# Altium schematic sheet nfc-epd-eink.SchDoc
size Letter
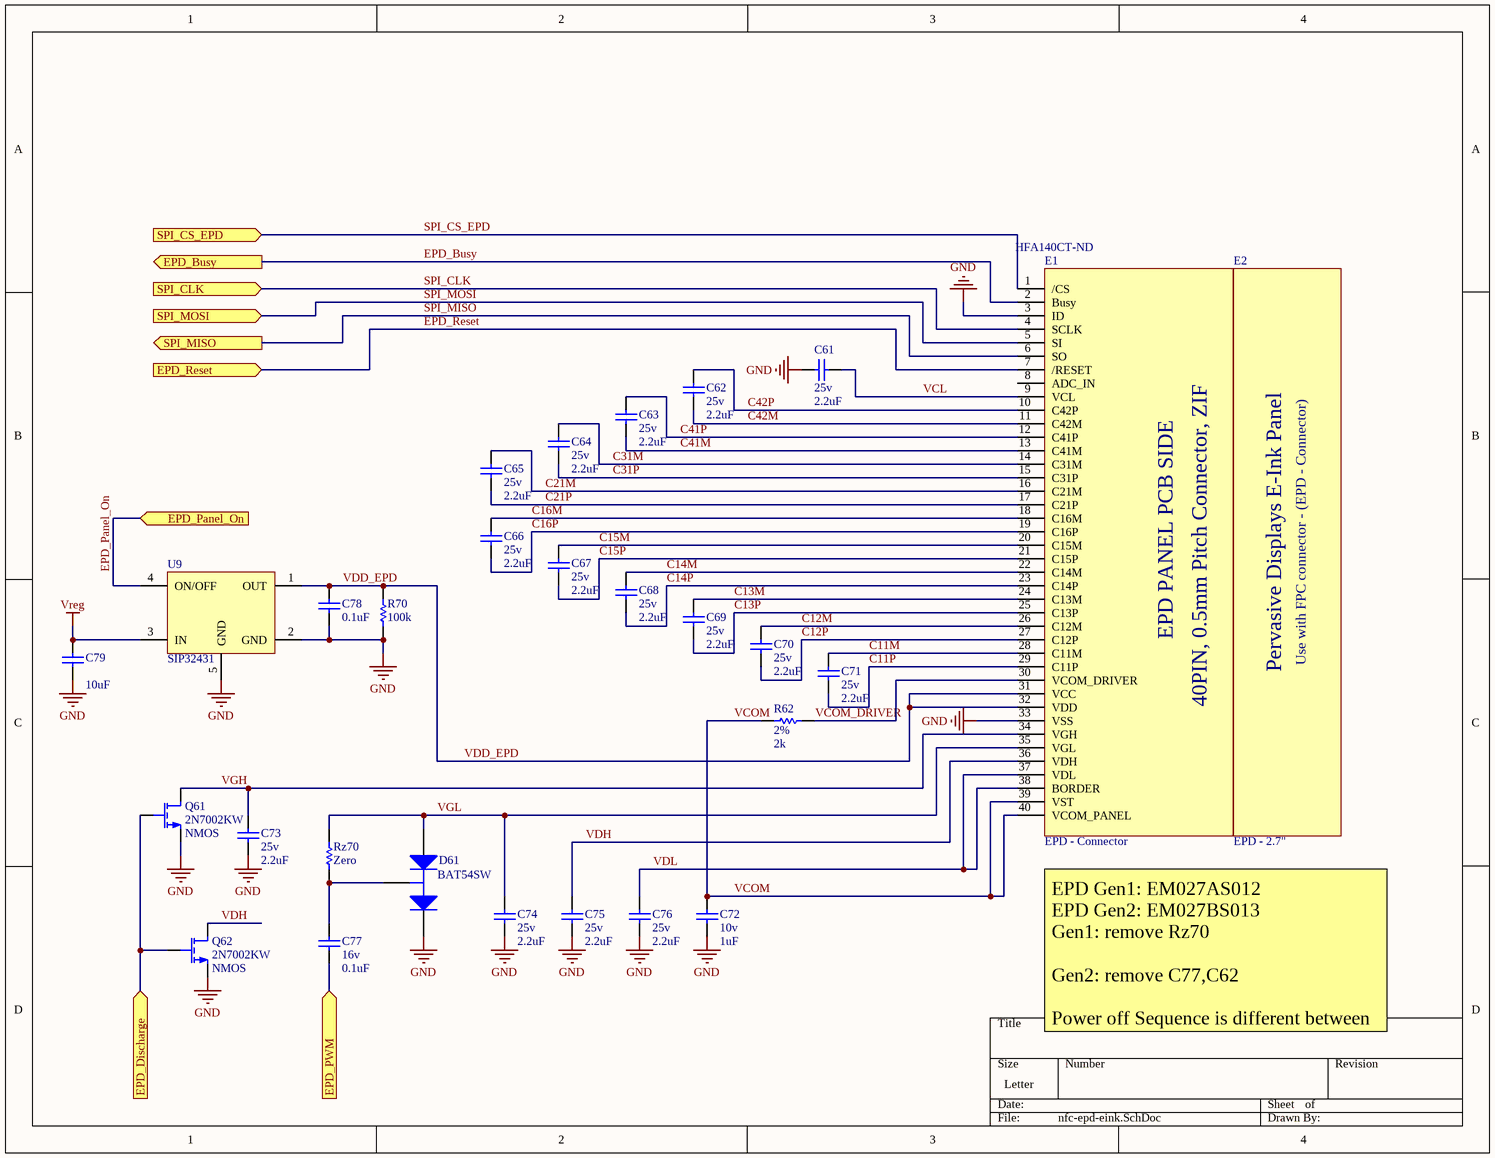
[diagram p0: nfc-epd-eink.SchDoc]

## Parts
C61  value 2.2uF  Rating: 25v  [0402]  (hidden comment: Cap)
C62  value 2.2uF  Rating: 25v  [0402]  (hidden comment: Cap)
C63  value 2.2uF  Rating: 25v  [0402]  (hidden comment: Cap)
C64  value 2.2uF  Rating: 25v  [0402]  (hidden comment: Cap)
C65  value 2.2uF  Rating: 25v  [0402]  (hidden comment: Cap)
C66  value 2.2uF  Rating: 25v  [0402]  (hidden comment: Cap)
C67  value 2.2uF  Rating: 25v  [0402]  (hidden comment: Cap)
C68  value 2.2uF  Rating: 25v  [0402]  (hidden comment: Cap)
C69  value 2.2uF  Rating: 25v  [0402]  (hidden comment: Cap)
C70  value 2.2uF  Rating: 25v  [0402]  (hidden comment: Cap)
C71  value 2.2uF  Rating: 25v  [0402]  (hidden comment: Cap)
C72  value 1uF  Rating: 10v  [0603]  (hidden comment: Cap)
C73  value 2.2uF  Rating: 25v  [0603]  (hidden comment: Cap)
C74  value 2.2uF  Rating: 25v  [0603]  (hidden comment: Cap)
C75  value 2.2uF  Rating: 25v  [0603]  (hidden comment: Cap)
C76  value 2.2uF  Rating: 25v  [0603]  (hidden comment: Cap)
C77  value 0.1uF  Rating: 16v  [0603]  (hidden comment: Cap)
C78  value 0.1uF  [0603]  (hidden comment: Cap)
C79  value 10uF  [0603]  (hidden comment: Cap)
D61  BAT54SW  [SOT-323 / SC-70]
E1  EPD - Connector  Supplier Part Number 1: HFA140CT-ND  [EPD - Connector]
E2  EPD - 2.7"  [EPD - EM027AS012]
Q61  2N7002KW  value NMOS  [SOT-323 / SC-70]
Q62  2N7002KW  value NMOS  [SOT-323 / SC-70]
R62  value 2k  Rating: 2%  [0603]  (hidden comment: Res)
R70  value 100k  [0603]  (hidden comment: Res)
Rz70  value Zero  [0603]  (hidden comment: Res)
U9  SIP32431  [TDFN-4]

## Ports
EPD_Busy (out), EPD_Discharge (in), EPD_Panel_On (in), EPD_PWM (in), EPD_Reset (in), SPI_CLK (in), SPI_CS_EPD (in), SPI_MISO (out), SPI_MOSI (in)

## Nets
GND: C61.2 C72.1 C73.1 C74.1 C75.1 C76.1 C78.1 C79.1 D61.2(K) E1.3(ID) E1.33(VSS) Q61.2(S) Q62.2(S) R70.1 U9.2(GND) U9.5(GND)
Vreg: C79.2 U9.3(IN)
C11M: C71.2 E1.28(C11M)
C11P: C71.1 E1.29(C11P)
C12M: C70.1 E1.26(C12M)
C12P: C70.2 E1.27(C12P)
C13M: C69.2 E1.24(C13M)
C13P: C69.1 E1.25(C13P)
C14M: C68.2 E1.22(C14M)
C14P: C68.1 E1.23(C14P)
C15M: C67.2 E1.20(C15M)
C15P: C67.1 E1.21(C15P)
C16M: C66.2 E1.18(C16M)
C16P: C66.1 E1.19(C16P)
C21M: C65.2 E1.16(C21M)
C21P: C65.1 E1.17(C21P)
C31M: C64.2 E1.14(C31M)
C31P: C64.1 E1.15(C31P)
C41M: C63.1 E1.13(C41M)
C41P: C63.2 E1.12(C41P)
C42M: C62.2 E1.11(C42M)
C42P: C62.1 E1.10(C42P)
EPD_Busy: E1.2(Busy) ; port EPD_Busy
EPD_Discharge: Q61.1(G) Q62.1(G) ; port EPD_Discharge
EPD_Panel_On: U9.4(ON/OFF) ; port EPD_Panel_On
EPD_PWM: C77.1 ; port EPD_PWM
EPD_Reset: E1.7(/RESET) ; port EPD_Reset
SPI_CLK: E1.4(SCLK) ; port SPI_CLK
SPI_CS_EPD: E1.1(/CS) ; port SPI_CS_EPD
SPI_MISO: E1.6(SO) ; port SPI_MISO
SPI_MOSI: E1.5(SI) ; port SPI_MOSI
VCL: C61.1 E1.9(VCL)
VCOM: C72.2 E1.39(VST) E1.40(VCOM_PANEL) R62.2
VCOM_DRIVER: E1.30(VCOM_DRIVER) R62.1
VDD_EPD: C78.2 E1.31(VCC) E1.32(VDD) R70.2 U9.1(OUT)
VDH: C75.2 E1.36(VDH) Q62.3(D)
VDL: C76.2 E1.37(VDL) E1.38(BORDER)
VGH: C73.2 E1.34(VGH) Q61.3(D)
VGL: C74.2 D61.1(A) E1.35(VGL) Rz70.1
NetC77_2: C77.2 D61.3(C) Rz70.2

Not connected (* = marked no-connect by the designer): E1 8(ADC_IN)

## Notes on the sheet
- EPD Gen1: EM027AS012
  EPD Gen2: EM027BS013
  Gen1: remove Rz70
  Gen2: remove C77,C62
  Power off Sequence is different between Gen1 and  Gen2 EPD
- (in symbol EPD - Connector) EPD PANEL PCB SIDE; 40PIN, 0.5mm Pitch Connector, ZIF
- (in symbol EPD - Display EM027AS012) Pervasive Displays E-Ink Panel; Use with FPC connector - (EPD - Connector)

## Library data of the parts
C61-C76 C78 C79 = Cap: Ceramic Capacitor (Surface Mount); Manufacturer: Generic Ceramic Chip Cap (TBD); Digi-Key Part Number: *; Manufacturer Part Number: *; Note: *
  C72: Supplier 1: Digi-Key; Supplier Part Number 1: 478-1251-1-ND
C77 = Cap: Ceramic Capacitor (Surface Mount); Manufacturer: Generic Ceramic Chip Cap (TBD); Note: DNP for Gen2 EPD; Digi-Key Part Number: *; Manufacturer Part Number: *
D61 = Diode - Array_1: Diode Array, Two in Series, Small Package SOT-323; Manufacturer: ON Semiconductor; Manufacturer Part Number: BAT54SWT1G; Note: *; Digi-Key Part Number: BAT54SWT1GOSCT-ND or (BAT54SW); Value: *; Rating: *
E1 = EPD - Connector: FPC, 40pin, 0.5mm Pitch - ZIF; Manufacturer: Hirose Electric Co Ltd; Manufacturer Part Number: FH12-40S-0.5SH or FH12S-40S-0.5SH; Digi-Key Part Number: HFJ140CT-ND or HFA140CT-ND; Note: *; Value: *; Rating: *; Supplier 1: Digi-Key
E2 = EPD - Display EM027AS012: 2.7" TFT EPD Panel, STARCONN 089H40 variant; Manufacturer: PERVASIVE DISPLAYS, INC; Note: Use for alignment purposes. No solder pads in footprint.; Digi-Key Part Number: EA-LCD-009-ND (should find another supplyer); Manufacturer Part Number: EM027AS012; Rating: *; Value: *
Q61 Q62 = MOSFET-N: N-Channel MOSFET; Manufacturer: Fairchild Semiconductor; Digi-Key Part Number: 2N7002KWCT-ND; Manufacturer Part Number: 2N7002KW; Notes: *; Rating: *; Supplier 1: Digi-Key; Supplier Part Number 1: 2N7002KWCT-ND
R62 R70 = Res: Chip Resistor (Surface Mount); Manufacturer: Generic Chip Res (TBD); Manufacturer Part Number: *; Digi-Key Part Number: *; Note: *
  R70: Rating: *
Rz70 = Res: Chip Resistor (Surface Mount); Manufacturer: Generic Chip Res (TBD); Manufacturer Part Number: RC0603FR-070RL; Digi-Key Part Number: *; Rating: *; Supplier 1: Digi-Key; Supplier Part Number 1: 311-0.0HRCT-ND
U9 = SIP32431: High Sside Switch - 4TDFN package; Manufacturer: Vishay Siliconix; Manufacturer Part Number: SIP32431DNP3-T1GE4; Digi-Key Part Number: SIP32431DNP3-T1GE4CT-ND; Note: *; Value: *; Rating: *